# Altium project Bluetooth_Module_Programmer.PrjPcb
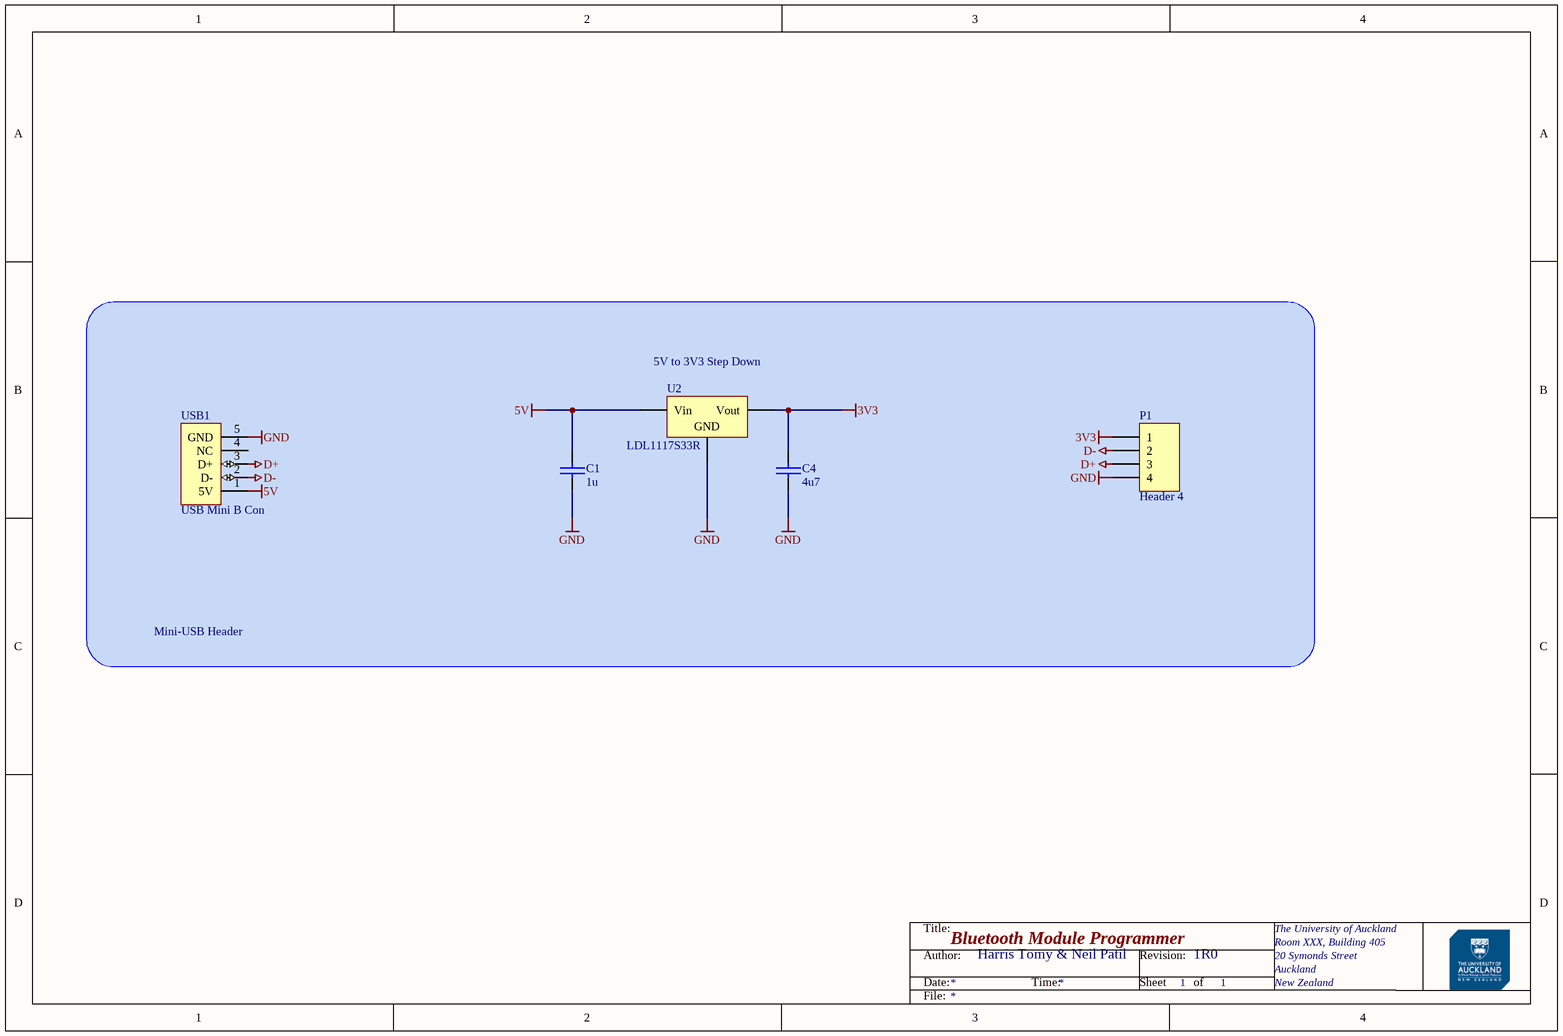
[diagram p0: Bluetooth_Module_Programmer.SchDoc]
1 sheet, 5 parts. Net scope: global (net labels, ports and power ports of the same name join across sheets).

## Sheet Bluetooth_Module_Programmer.SchDoc: Bluetooth Module
size A4; Author: Harris Tomy & Neil Patil; Organization: The University of Auckland; Address1: Room XXX, Building 405; Address2: 20 Symonds Street; Address3: Auckland; Address4: New Zealand; Revision: 1R0; SheetNumber: 1; SheetTotal: 1

### Parts
C1  1u  [C1206]
C4  4u7  [C1206]
P1  Header 4  [HDR1X4]
U2  LDL1117S33R  [SOT223L]
USB1  USB Mini B Con  [USB_UJ2MAB]

### Nets
3V3: C4.2 P1.1 U2.2(Vout)
5V: C1.2 U2.3(Vin) USB1.1(5V)
D+: P1.3 USB1.3(D+)
D-: P1.2 USB1.2(D-)
GND: C1.1 C4.1 P1.4 U2.1(GND) USB1.5(GND)

Not connected (* = marked no-connect by the designer): USB1 4(NC)

### Notes on the sheet
- (near U2) 5V to 3V3 Step Down
- Mini-USB Header
- Title:
- Author:
- Date:
- Bluetooth Module Programmer
- Time:
- Revision:
- Sheet
- of
- File:

### Library data of the parts
C1 C4 = Cap CER Decoup C3216C0G2A104J160AC: CAP CER 0.1UF 100V C0G 1206; Manufacturer: TDK Corporation; Type: Surface mount; Value: 100nF/100V; MPN: C3216C0G2A104J160AC; Part Description: CAP CER 0.1UF 100V C0G 1206; Supplier 1: RSComponents; Supplier Part Number 1: 1795799; Supplier 2: Element14; Supplier Part Number 4: 810-C3216C0G2A104J6C; Supplier Part Number 3: 445-172677-1-ND; Supplier Part Number 2: 2906828; Supplier 4: Mouser; Supplier 3: Digi-Key
P1 = Header 4: Header, 4-Pin; LatestRevisionDate: 17-Jul-2002; LatestRevisionNote: Re-released for DXP Platform.; Publisher: Altium Limited
U2 = LDO LDL1117S33R: IC REG LINEAR 3.3V 1.2A SOT223; Manufacturer: STMicroelectronics; Value: 3.3V/1.2A; MPN: LDL1117S33R; Supplier 1: Element14; Type: Surface mount; Part Description: IC REG LINEAR 3.3V 1.2A SOT223; Supplier Part Number 3: 511-LDL1117S33R; Supplier Part Number 2: 497-17239-1-ND; Supplier Part Number 1: 2729708; Supplier 3: Mouser; Supplier 2: Digi-Key
USB1 = USBMiniB: Supplier 1: Digi-Key; Supplier Part Number 1: 102-4004-1-ND